# Altium project WiFiDevBoard.PrjPcb
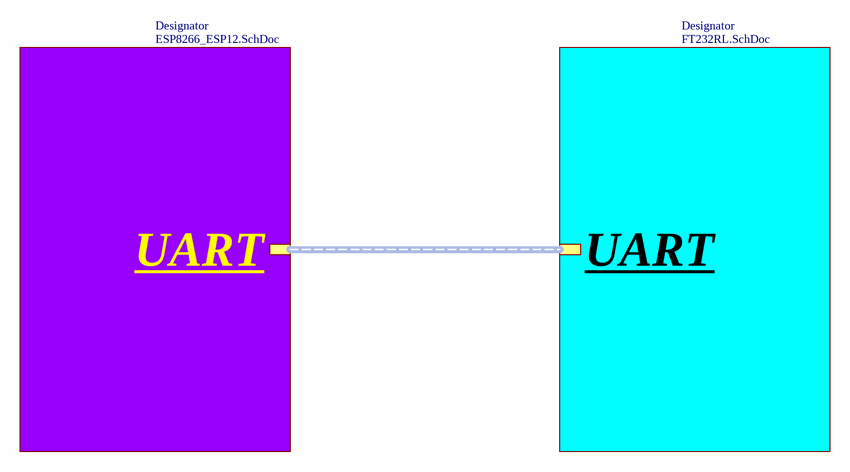
[diagram p0: WiFiBoard.SchDoc]
3 sheets, 26 parts. Net scope: hierarchical (ports join the sheet entries above them; power ports are global).
Board file: WiFiBoard.PcbDoc
Sheets:
  WiFiBoard.SchDoc
    Designator = ESP8266_ESP12.SchDoc
    Designator = FT232RL.SchDoc

## Sheet WiFiBoard.SchDoc
size A4; SheetNumber: 1; SheetTotal: 3

### Sub-sheets
Designator = ESP8266_ESP12.SchDoc: UART (harness UART)
Designator = FT232RL.SchDoc: UART (harness UART)

## Sheet ESP8266_ESP12.SchDoc
size A4; SheetNumber: 2; SheetTotal: 3
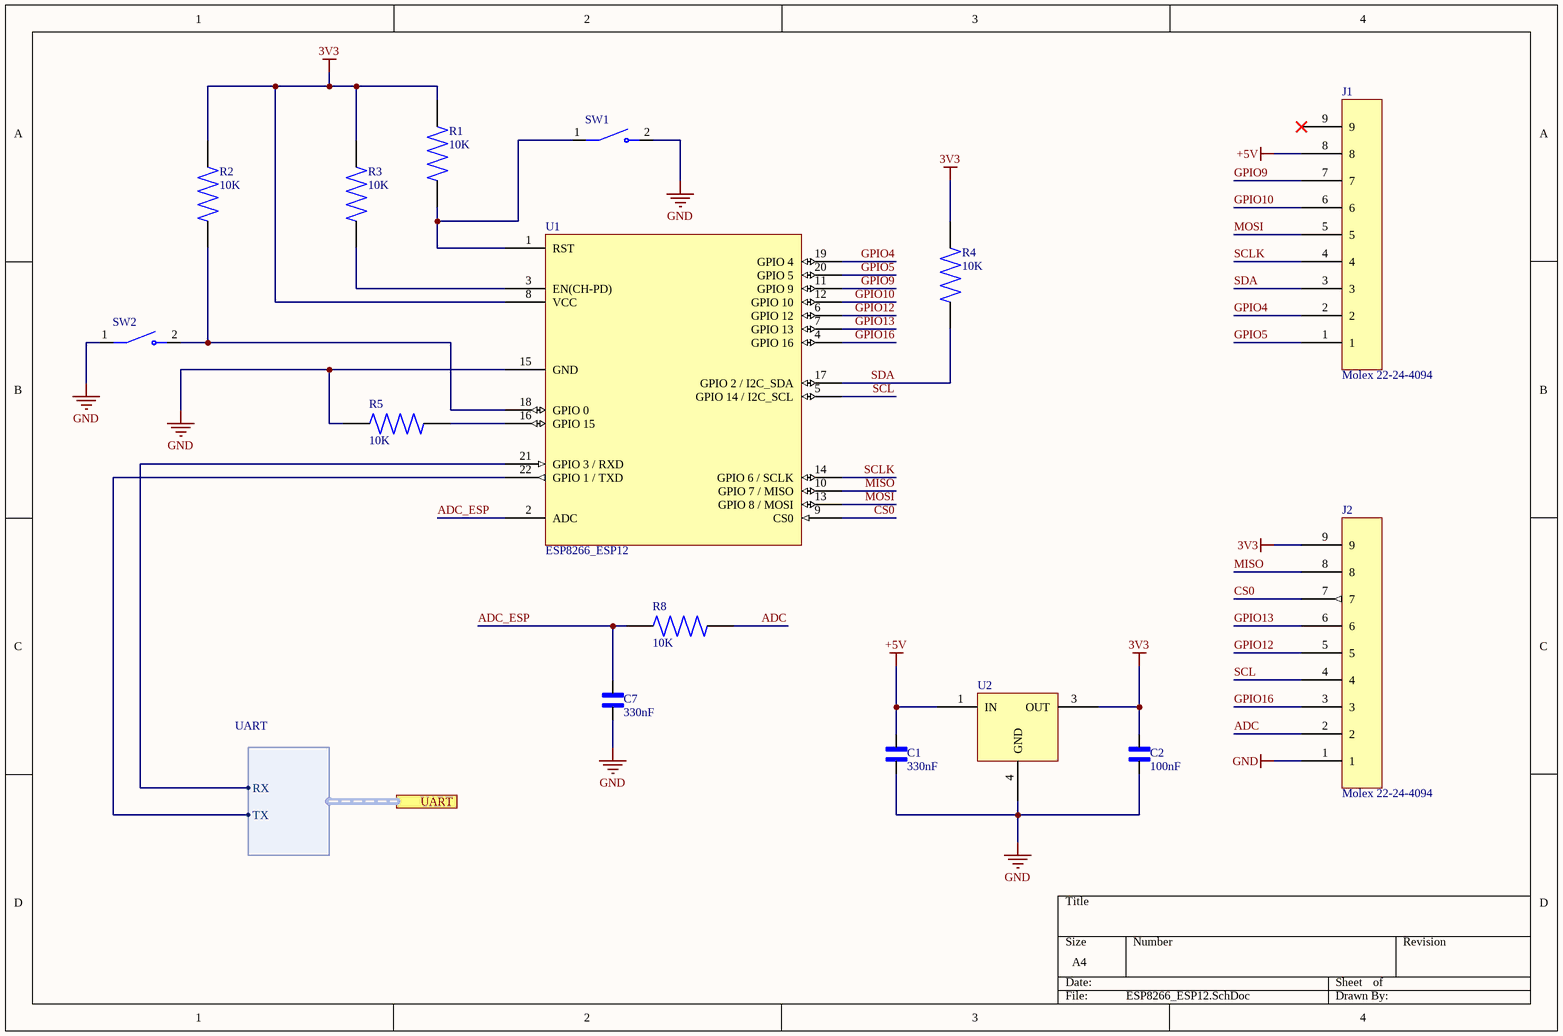
[diagram p1: ESP8266_ESP12.SchDoc]

### Parts
C1  330nF  [CAPC1608X90N]
C2  100nF  [CAPC1608X90N]
C7  330nF  [CAPC1608X90N]
J1  Molex 22-24-4094  [Molex 22-28-4094]
J2  Molex 22-24-4094  [Molex 22-28-4094]
R1  10K  [RESC1508X50N]
R2  10K  [RESC1508X50N]
R3  10K  [RESC1508X50N]
R4  10K  [RESC1508X50N]
R5  10K  [RESC1508X50N]
R8  10K  [RESC1508X50N]
SW1  B3U-1000P  [SW_B3U-1000P]  (value not drawn)
SW2  B3U-1000P  [SW_B3U-1000P]  (value not drawn)
U1  ESP8266_ESP12  [ESP8266-ESP12]
U2  UA78M33CDCY  [UA78M33CDCY]  (value not drawn)

### Ports
UART (harness UART, see WiFiBoard[2B], FT232RL[4A])

### Harnesses
UART: RX, TX

### Nets
3V3: C2.2 J2.9 R1.2 R2.2 R3.2 R4.2 U1.8(VCC) U2.3(OUT)
+5V: C1.2 J1.8 U2.1(IN)
GND: C1.1 C2.1 C7.1 J2.1 R5.1 SW1.2 SW2.1 U1.15(GND) U2.4(GND)
ADC: J2.2 R8.2
ADC_ESP: C7.2 R8.1 U1.2(ADC)
CS0: J2.7 U1.9(CS0)
GPIO4: J1.2 U1.19(GPIO_4)
GPIO5: J1.1 U1.20(GPIO_5)
GPIO9: J1.7 U1.11(GPIO_9)
GPIO10: J1.6 U1.12(GPIO_10)
GPIO12: J2.5 U1.6(GPIO_12)
GPIO13: J2.6 U1.7(GPIO_13)
GPIO16: J2.3 U1.4(GPIO_16)
MISO: J2.8 U1.10(GPIO_7_/_MISO)
MOSI: J1.5 U1.13(GPIO_8_/_MOSI)
SCL: J2.4 U1.5(GPIO_14_/_I2C_SCL)
SCLK: J1.4 U1.14(GPIO_6_/_SCLK)
SDA: J1.3 R4.1 U1.17(GPIO_2_/_I2C_SDA)
NetR1_1: R1.1 SW1.1 U1.1(RST)
NetR2_1: R2.1 SW2.2 U1.18(GPIO_0)
NetR3_1: R3.1 U1.3(EN(CH-PD))
NetR5_2: R5.2 U1.16(GPIO_15)
NetU1_21: U1.21(GPIO_3_/_RXD) ; port UART.RX

Not connected (* = marked no-connect by the designer): J1 9*; U1 22(GPIO_1_/_TXD)

### Library data of the parts
C1 C2 C7 = GRM188R71C104KA01D: MF: {'manufacturer': u'Murata'}; Package: None; Price: None; Value: *; MP: GRM188R71C104KA01D; Availability: Unavailable
J1 J2 = Molex
R1-R5 R8 = CRCW06032K20FKEA: MF: {'manufacturer': u'Vishay Dale'}; Package: None; Price: None; Value: *; MP: CRCW06032K20FKEA; Availability: Unavailable
SW1 SW2 = B3U-1000P: Switch Tactile N.O. SPST Round Button Gull Wing 0.05A 12VDC 1.5N SMD Embossed T/R; Price: None; MP: B3U-1000P; Availability: Unavailable; Value: *; Package: None
U2 = UA78M33CDCY: TI (Texas Instruments) UA78M33CDCY

## Sheet FT232RL.SchDoc
size A4; SheetNumber: 3; SheetTotal: 3
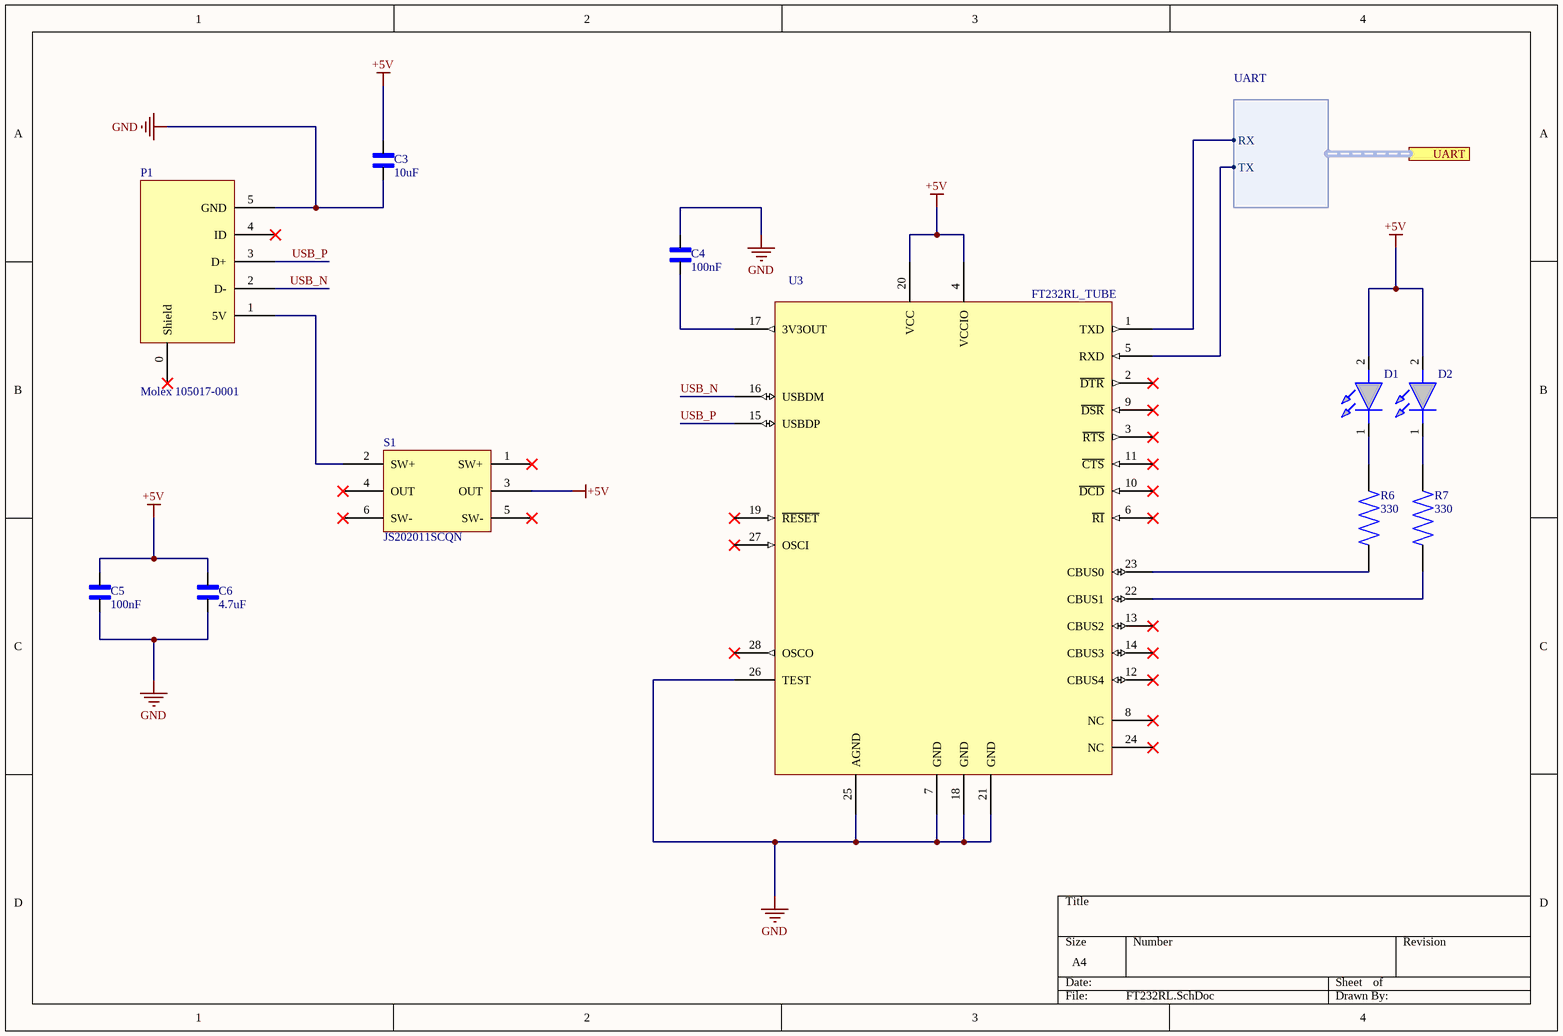
[diagram p2: FT232RL.SchDoc]

### Parts
C3  10uF  [CAPC1608X90N]
C4  100nF  [CAPC1608X90N]
C5  100nF  [CAPC1608X90N]
C6  4.7uF  [CAPC1608X90N]
D1  VLMTG1300-GS08  [LEDC1608X100N]  (value not drawn)
D2  VLMTG1300-GS08  [LEDC1608X100N]  (value not drawn)
P1  Molex 105017-0001  [Molex 105017-0001]
R6  330  [RESC1508X50N]
R7  330  [RESC1508X50N]
S1  JS202011SCQN  [SW_JS202011SCQN]
U3  FT232RL_TUBE  [FT232RL_TUBE]

### Ports
UART (harness UART, see WiFiBoard[3B], ESP8266_ESP12[2D])

### Harnesses
UART: RX, TX

### Nets
+5V: C3.2 C5.2 C6.2 D1.2(A) D2.2(A) S1.3(OUT) U3.4(VCCIO) U3.20(VCC)
GND: C3.1 C4.2 C5.1 C6.1 P1.5(GND) U3.7(GND) U3.18(GND) U3.21(GND) U3.25(AGND) U3.26(TEST)
USB_N: P1.2(D-) U3.16(USBDM)
USB_P: P1.3(D+) U3.15(USBDP)
NetC4_1: C4.1 U3.17(3V3OUT)
NetD1_1: D1.1(K) R6.2
NetD2_1: D2.1(K) R7.2
NetP1_1: P1.1(5V) S1.2(SW+)
NetR6_1: R6.1 U3.23(CBUS0)
NetR7_1: R7.1 U3.22(CBUS1)
NetU1_21: U3.1(TXD) ; port UART.RX
NetU3_5: U3.5(RXD) ; port UART.TX

Not connected (* = marked no-connect by the designer): P1 0(Shield)* 4(ID)*; S1 1(SW+)* 4(OUT)* 5(SW-)* 6(SW-)*; U3 2(~{DTR})* 3(~{RTS})* 6(~{RI})* 8(NC)* 9(~{DSR})* 10(~{DCD})* 11(~{CTS})* 12(CBUS4)* 13(CBUS2)* 14(CBUS3)* 19(~{RESET})* 24(NC)* 27(OSCI)* 28(OSCO)*

### Library data of the parts
C3-C6 = GRM188R71C104KA01D: MF: {'manufacturer': u'Murata'}; Package: None; Price: None; Value: *; MP: GRM188R71C104KA01D; Availability: Unavailable
D1 D2 = VLMTG1300-GS08: Vishay VLMTG1300-GS08, 525 nm Green LED, 1608 (0603) SMD package; Geometry.Height: 1mm; Future Part Number: *; Future Price/Stock: *; Manufacturer_Name: Vishay; Manufacturer_Part_Number: VLMTG1300-GS08; Datasheet Link: https://www.vishay.com/docs/82437/vlmo1300.pdf
P1 = Molex 105017-0001: CONN RCPT MICRO USB R/A SMD
R6 R7 = CRCW06032K20FKEA: MF: {'manufacturer': u'Vishay Dale'}; Package: None; Price: None; Value: *; MP: CRCW06032K20FKEA; Availability: Unavailable
S1 = SW_JS202011SCQN: JS Series DPDT On-On Gull Wing Surface Mount Subminiature Slide Switch
U3 = FT232RL_TUBE: FT232RL-Tube / USB UART Asynchronous Serial Data Transfer Chip, 28-pin SSOP, Tube

## Nets that join several sheets
+5V: ESP8266_ESP12 (C1.2 J1.8 U2.1), FT232RL (8 pins)
GND: ESP8266_ESP12 (9 pins), FT232RL (10 pins)
NetU1_21: ESP8266_ESP12 (U1.21), FT232RL (U3.1)